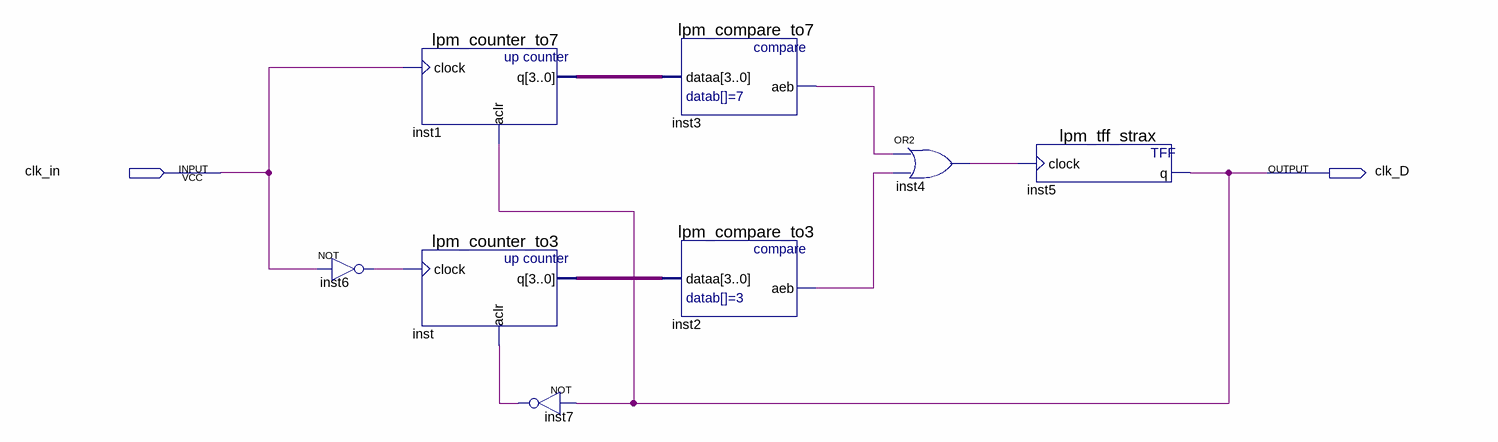
[diagram p0: schematic sheet]
// Quartus schematic Block_2_v2.bdf as structural Verilog: 8 symbols, 2 pins
module Block_2_v2 (
  input  clk_in,
  output clk_D
);

  wire inst2_aeb, inst3_aeb, inst4_out, inst6_out, inst7_out;
  wire [3:0] inst1_q, inst_q;

  not inst6 (inst6_out, clk_in);
  lpm_counter_to7 inst1 (.clock(clk_in), .aclr(clk_D), .q(inst1_q));
  lpm_counter_to3 inst (.clock(inst6_out), .aclr(inst7_out), .q(inst_q));
  not inst7 (inst7_out, clk_D);
  lpm_compare_to7 inst3 (.dataa(inst1_q), .aeb(inst3_aeb));
  lpm_compare_to3 inst2 (.dataa(inst_q), .aeb(inst2_aeb));
  or inst4 (inst4_out, inst3_aeb, inst2_aeb);
  lpm_tff_strax inst5 (.clock(inst4_out), .q(clk_D));
endmodule
